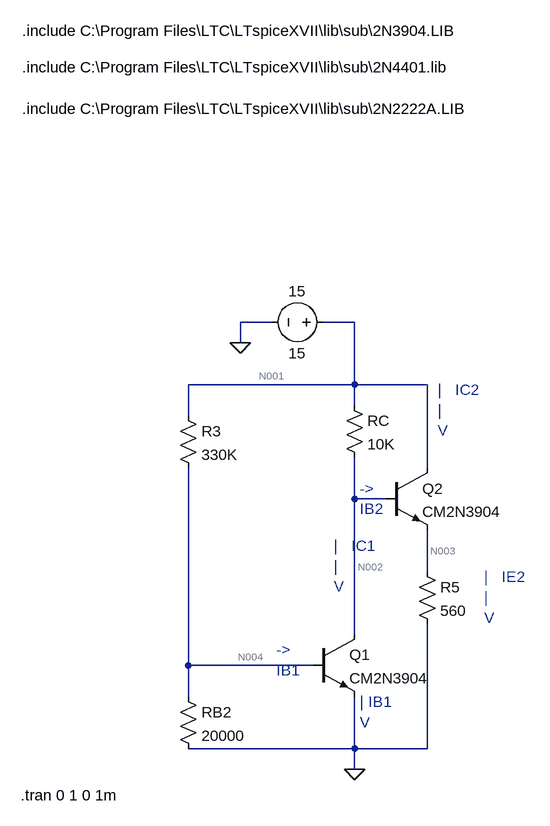
[diagram p0: schematic part C DC bias.asc]
part C DC bias.asc, the LTspice schematic file:
Version 4
SHEET 1 1036 996
WIRE 48 128 0 128
WIRE 176 128 128 128
WIRE 0 160 0 128
WIRE 176 224 176 128
WIRE 176 224 -80 224
WIRE 288 224 176 224
WIRE 176 256 176 224
WIRE -80 272 -80 224
WIRE 288 352 288 224
WIRE 176 400 176 336
WIRE 224 400 176 400
WIRE 288 512 288 448
WIRE 176 608 176 400
WIRE -80 656 -80 352
WIRE 112 656 -80 656
WIRE -80 704 -80 656
WIRE 176 784 176 704
WIRE 176 784 -80 784
WIRE 288 784 288 592
WIRE 288 784 176 784
WIRE 176 816 176 784
FLAG 0 160 0
FLAG 176 816 0
SYMBOL npn 112 608 R0
SYMATTR InstName Q1
SYMATTR Value CM2N3904
SYMBOL npn 224 352 R0
SYMATTR InstName Q2
SYMATTR Value CM2N3904
SYMBOL res 160 240 R0
SYMATTR InstName RC
SYMATTR Value 10K
SYMBOL voltage 144 128 R90
WINDOW 0 -32 56 VBottom 2
WINDOW 3 32 56 VTop 2
SYMATTR InstName 15
SYMATTR Value 15
SYMBOL res -96 688 R0
SYMATTR InstName RB2
SYMATTR Value 20000
SYMBOL res -96 256 R0
SYMATTR InstName R3
SYMATTR Value 330K
SYMBOL res 272 496 R0
SYMATTR InstName R5
SYMATTR Value 560
TEXT -336 -200 Left 2 !.include C:\\Program Files\\LTC\\LTspiceXVII\\lib\\sub\\2N2222A.LIB
TEXT -336 -264 Left 2 !.include C:\\Program Files\\LTC\\LTspiceXVII\\lib\\sub\\2N4401.lib
TEXT -336 -320 Left 2 !.include C:\\Program Files\\LTC\\LTspiceXVII\\lib\\sub\\2N3904.LIB
TEXT 376 520 Left 2 ;|   IE2 \n|\nV
TEXT 184 712 Left 2 ;| IB1 \nV
TEXT 144 472 Left 2 ;|   IC1 \n|\nV
TEXT 184 384 Left 2 ;->\nIB2
TEXT 56 632 Left 2 ;->\nIB1
TEXT -338 856 Left 2 !.tran 0 1 0 1m
TEXT 304 232 Left 2 ;|   IC2 \n|\nV

The netlist it stands for:
* part C DC bias.asc
Q1 N002 N004 0 0 CM2N3904
Q2 N001 N002 N003 0 CM2N3904
RC N001 N002 10K
V§15 N001 0 15
RB2 N004 0 20000
R3 N001 N004 330K
R5 N003 0 560
.model NPN NPN
.model PNP PNP
.lib standard.bjt
.include C:\Program Files\LTC\LTspiceXVII\lib\sub\2N2222A.LIB
.include C:\Program Files\LTC\LTspiceXVII\lib\sub\2N4401.lib
.include C:\Program Files\LTC\LTspiceXVII\lib\sub\2N3904.LIB
* |   IE2
* |
* V
* | IB1
* V
* |   IC1
* |
* V
* ->
* IB2
* ->
* IB1
.tran 0 1 0 1m
* |   IC2
* |
* V
.backanno
.end

* Results of the author's LTspice run, read from the files saved beside the schematic
* Operating Point, zero values left out:
*   V(n002) = 1.901 V
*   V(n004) = 654.1 mV
*   V(n001) = 15 V
*   V(n003) = 1.236 V
*   Ic(Q2) = 2.192 mA
*   Ib(Q2) = 15.4 µA
*   Ie(Q2) = -2.207 mA
*   Ic(Q1) = 1.294 mA
*   Ib(Q1) = 10.77 µA
*   Ie(Q1) = -1.305 mA
*   I(R5) = 2.207 mA
*   I(R3) = 43.47 µA
*   I(Rb2) = 32.7 µA
*   I(Rc) = 1.31 mA
*   I(15) = -3.545 mA
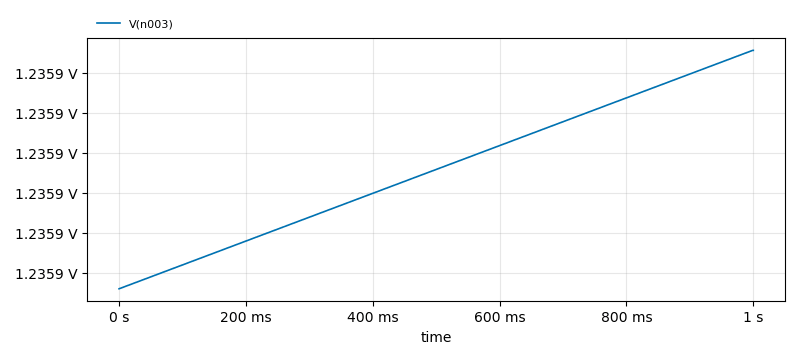
[diagram p1: Transient Analysis of part C DC bias.asc, plotted from the saved traces]
* Transient Analysis, 1 run:
*   V(n003): min 1.236 V, max 1.236 V, average 1.236 V, rms 1.236 V, last 1.236 V